# Altium schematic sheet Resistor - 121-145.SchDoc
size A0; SheetNumber: 3; SheetTotal: 14
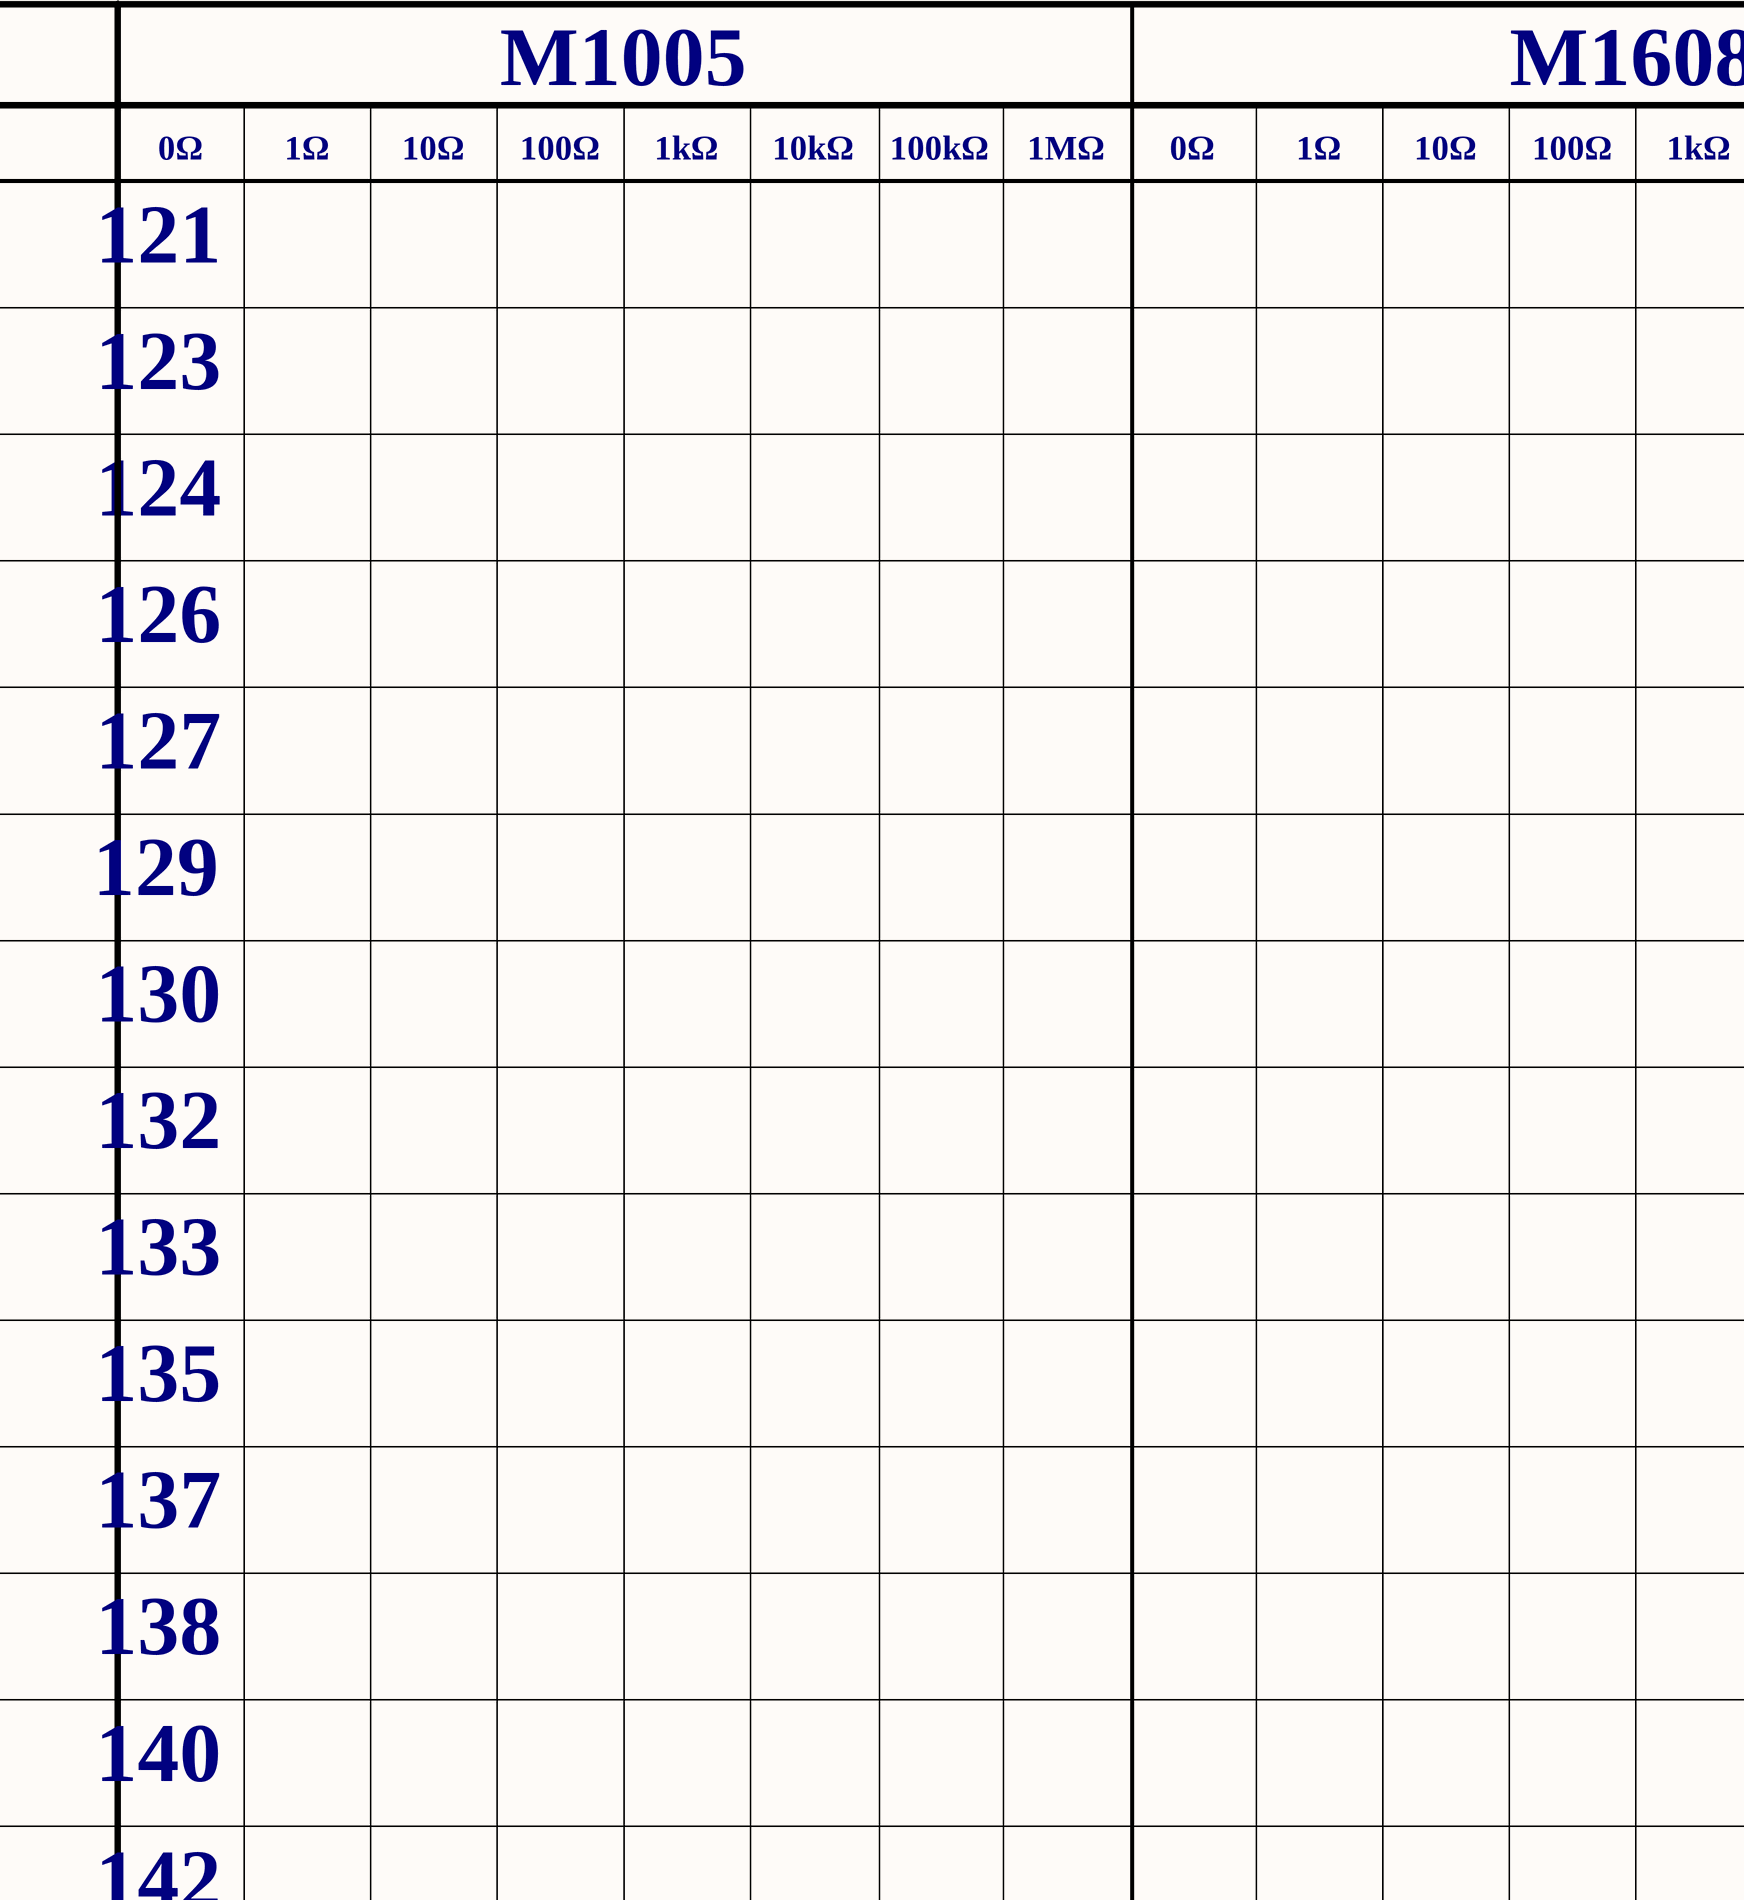
[diagram p0: Resistor - 121-145.SchDoc, top left]
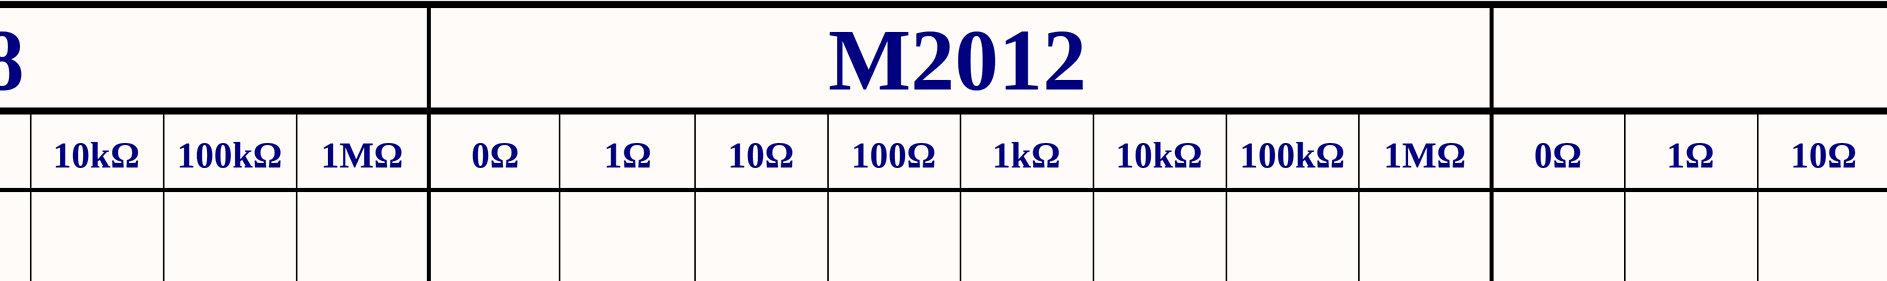
[diagram p1: Resistor - 121-145.SchDoc, top middle]
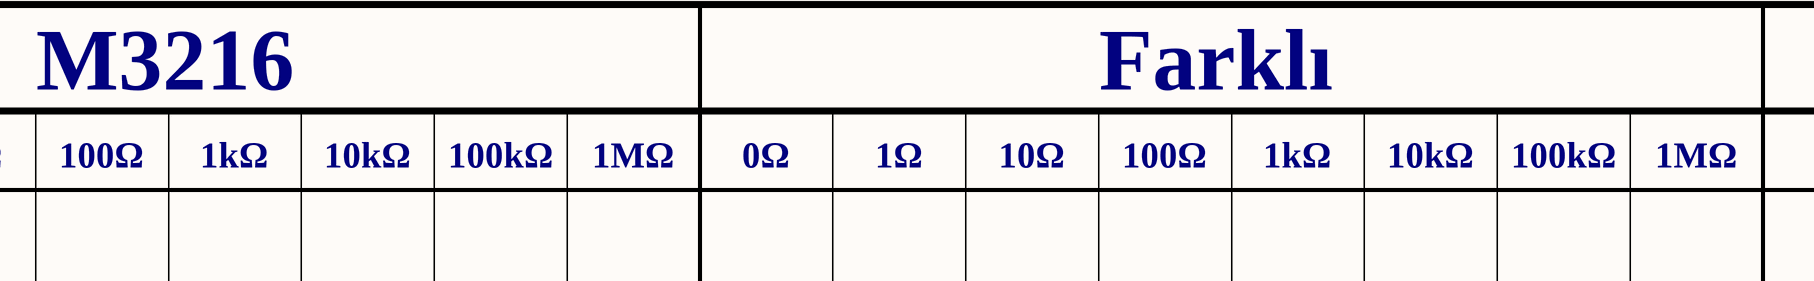
[diagram p2: Resistor - 121-145.SchDoc, top right]
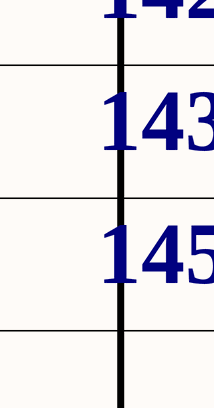
[diagram p3: Resistor - 121-145.SchDoc, bottom left]

## Notes on the sheet
- M1005
- M1608
- M2012
- M3216
- Farklı
- 0Ω
- 1Ω
- 10Ω
- 100Ω
- 1kΩ
- 10kΩ
- 100kΩ
- 1MΩ
- 121
- 123
- 124
- 126
- 127
- 129
- 130
- 132
- 133
- 135
- 137
- 138
- 140
- 142
- 143
- 145